# Altium project Driver.PrjPcb
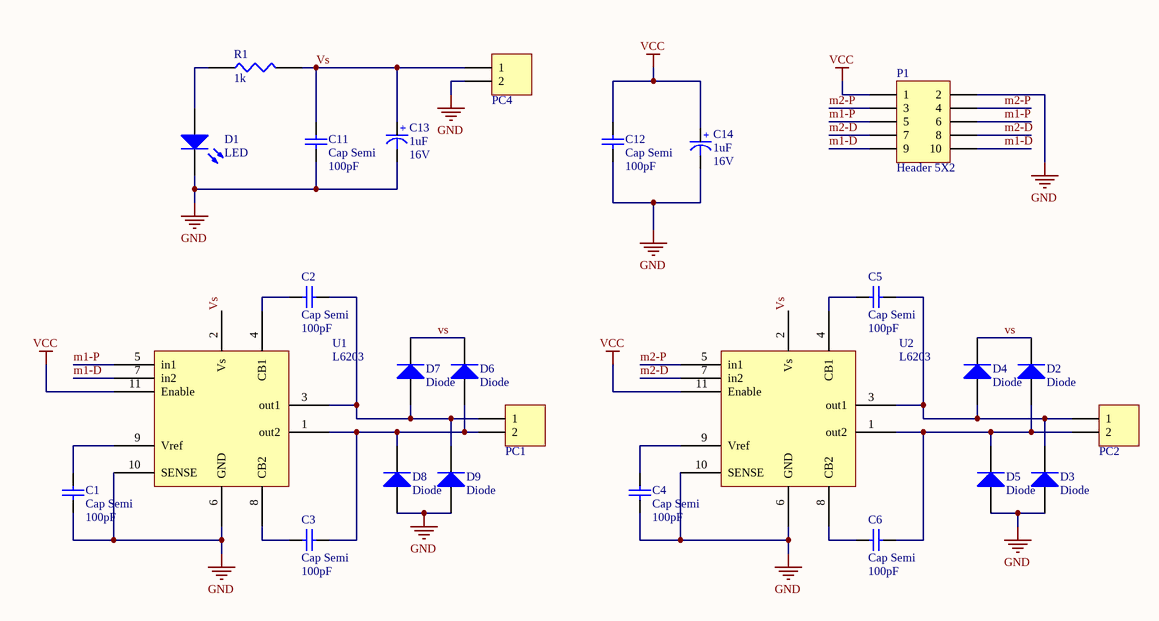
[diagram p0: Driver.SchDoc]
1 sheet, 26 parts. Net scope: global (net labels, ports and power ports of the same name join across sheets).
Board file: Driver.PcbDoc

## Sheet Driver.SchDoc
size A3

### Parts
C1  Cap Semi  value 100pF  [C1206]
C2  Cap Semi  value 100pF  [C1206]
C3  Cap Semi  value 100pF  [C1206]
C4  Cap Semi  value 100pF  [C1206]
C5  Cap Semi  value 100pF  [C1206]
C6  Cap Semi  value 100pF  [C1206]
C11  Cap Semi  value 100pF  [C1206]
C12  Cap Semi  value 100pF  [C1206]
C13  Voltage: 16V  [cap 03]  (hidden comment: 1uF)
C14  Voltage: 16V  [cap 03]  (hidden comment: 1uF)
D1  LED  [My_LED3MM]
D2  Diode  [SMC]
D3  Diode  [SMC]
D4  Diode  [SMC]
D5  Diode  [SMC]
D6  Diode  [SMC]
D7  Diode  [SMC]
D8  Diode  [SMC]
D9  Diode  [SMC]
P1  Header 5X2  [HDR2X5]
PC1  Power Connector  [My_ Power_Connector]  (value not drawn)
PC2  Power Connector  [My_ Power_Connector]  (value not drawn)
PC4  Power Connector  [My_ Power_Connector]  (value not drawn)
R1  1k  [My_axial-0.4]
U1  L6203  [PCBComponent_1]
U2  L6203  [PCBComponent_1]

### Nets
GND: C1.1 C4.1 C11.1 C12.1 C13.2(-) C14.2(-) D1.K D3.1(A) D5.1(A) D8.1(A) D9.1(A) P1.2 PC4.2 U1.6(GND) U1.10(SENSE) U2.6(GND) U2.10(SENSE)
VCC: C12.2 C14.1(+) P1.1 U1.11(Enable) U2.11(Enable)
m1-D: P1.9 P1.10 U1.7(in2)
m1-P: P1.5 P1.6 U1.5(in1)
m2-D: P1.7 P1.8 U2.7(in2)
m2-P: P1.3 P1.4 U2.5(in1)
Vs: C11.2 C13.1(+) D2.2(K) D4.2(K) D6.2(K) D7.2(K) PC4.1 R1.2 U1.2(Vs) U2.2(Vs)
NetC1_2: C1.2 U1.9(Vref)
NetC2_1: C2.1 U1.4(CB1)
NetC2_2: C2.2 D7.1(A) D9.2(K) PC1.1 U1.3(out1)
NetC3_1: C3.1 U1.8(CB2)
NetC3_2: C3.2 D6.1(A) D8.2(K) PC1.2 U1.1(out2)
NetC4_2: C4.2 U2.9(Vref)
NetC5_1: C5.1 U2.4(CB1)
NetC5_2: C5.2 D3.2(K) D4.1(A) PC2.1 U2.3(out1)
NetC6_1: C6.1 U2.8(CB2)
NetC6_2: C6.2 D2.1(A) D5.2(K) PC2.2 U2.1(out2)
NetD1_A: D1.A R1.1

### Library data of the parts
C1-C6 C11 C12 = Cap Semi: Capacitor (Semiconductor SIM Model); Published: 8-Jun-2000; LatestRevisionDate: 29-May-2009; LatestRevisionNote: IPC-7351 Footprint Added.; PackageReference: C1206; Publisher: Altium Limited; PackageDescription: Chip Capacitor
C13 C14 = Cap-Polar: Polar Capacitor; Designer: Saeid Jorablo; Organazation: ControTec; Adding Date: 1387/12/20; Value: 1uF
D1 = LED: Typical INFRARED GaAs LED; Published: 8-Jun-2000; LatestRevisionDate: 08-Jul-2005; LatestRevisionNote: Mech Layer 1 removed.; Publisher: Altium Limited
D2-D9 = Diode: Default Diode; Published: 8-Jun-2000; LatestRevisionDate: 17-Jul-2002; LatestRevisionNote: Re-released for DXP Platform.; PackageVersion: Sep-1996; PackageReference: SMC; Publisher: Altium Limited; PackageDescription: DO-214-AB/SMC; 2 C-Bend Leads; Body 7.9 x 5.9 mm, inc. leads (LxW); Code_JEDEC: DO-214-AB
P1 = Header 5X2: Header, 5-Pin, Dual row; LatestRevisionDate: 17-Jul-2002; LatestRevisionNote: Re-released for DXP Platform.; Publisher: Altium Limited
PC1 PC2 PC4 = Power Connector: white Power Connector
R1 = Res: resistor 1/4 wat; Value: 1k